# Altium schematic sheet AND_OR_XOR_NOT.SchDoc
size A
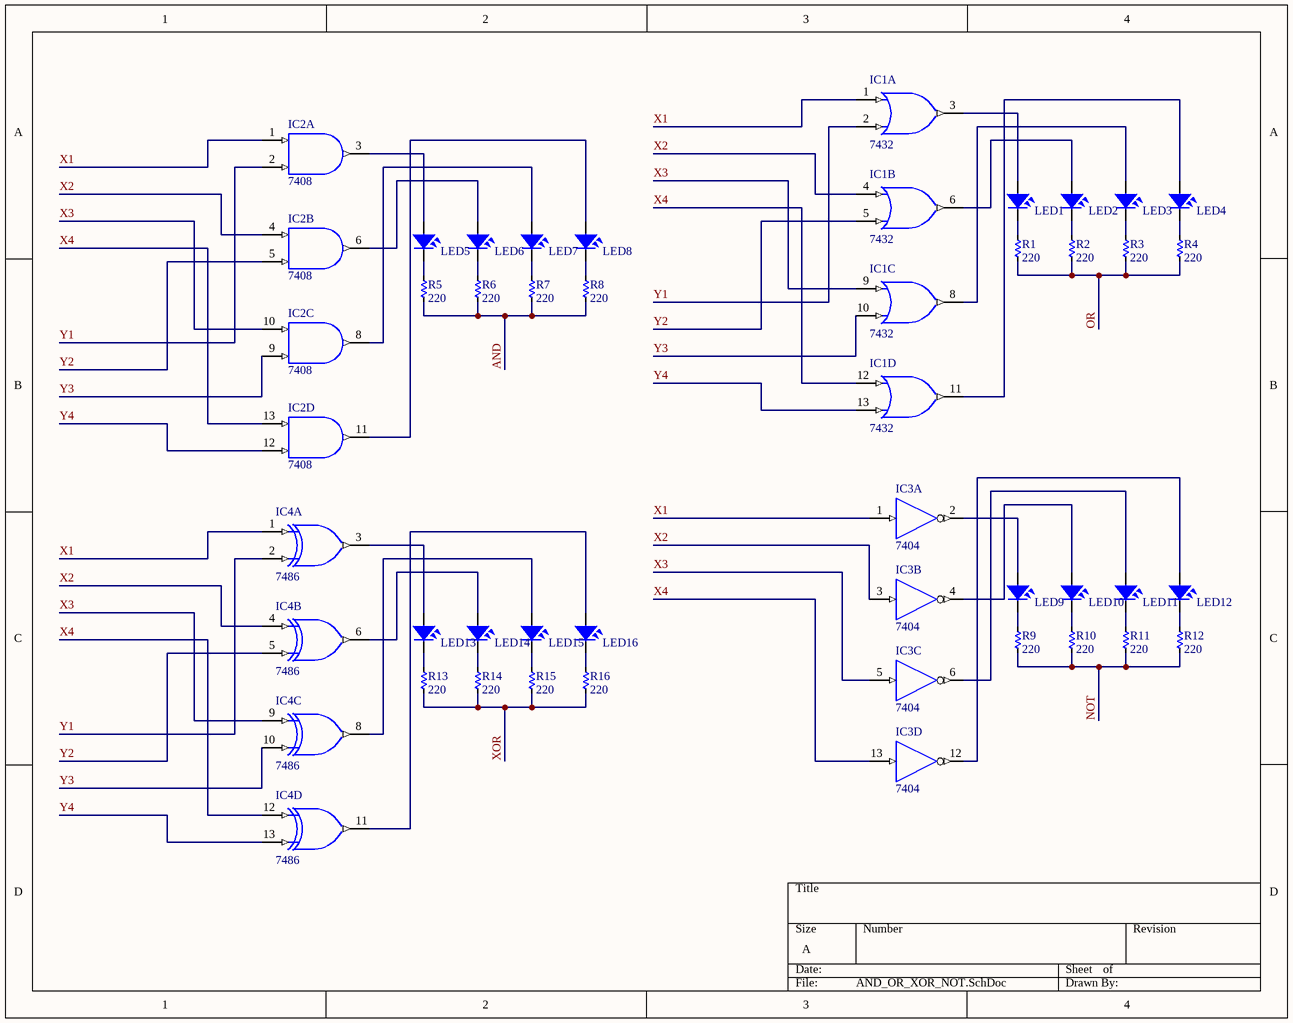
[diagram p0: AND_OR_XOR_NOT.SchDoc]

## Parts
IC1  7432  [DIP14]  (parts A,B,C,D of 4)
IC2  7408  [DIP14]  (parts A,B,C,D of 4)
IC3  7404  [DIP14]  (parts A,B,C,D of 6)
IC4  7486  [DIP14]  (parts A,B,C,D of 4)
LED1  LED  [LED-3MM-YELLOW]  (value not drawn)
LED2  LED  [LED-3MM-YELLOW]  (value not drawn)
LED3  LED  [LED-3MM-YELLOW]  (value not drawn)
LED4  LED  [LED-3MM-YELLOW]  (value not drawn)
LED5  LED  [LED-3MM-YELLOW]  (value not drawn)
LED6  LED  [LED-3MM-YELLOW]  (value not drawn)
LED7  LED  [LED-3MM-YELLOW]  (value not drawn)
LED8  LED  [LED-3MM-YELLOW]  (value not drawn)
LED9  LED  [LED-3MM-YELLOW]  (value not drawn)
LED10  LED  [LED-3MM-YELLOW]  (value not drawn)
LED11  LED  [LED-3MM-YELLOW]  (value not drawn)
LED12  LED  [LED-3MM-YELLOW]  (value not drawn)
LED13  LED  [LED-3MM-YELLOW]  (value not drawn)
LED14  LED  [LED-3MM-YELLOW]  (value not drawn)
LED15  LED  [LED-3MM-YELLOW]  (value not drawn)
LED16  LED  [LED-3MM-YELLOW]  (value not drawn)
R1  220  [RES-1/2W]
R2  220  [RES-1/2W]
R3  220  [RES-1/2W]
R4  220  [RES-1/2W]
R5  220  [RES-1/2W]
R6  220  [RES-1/2W]
R7  220  [RES-1/2W]
R8  220  [RES-1/2W]
R9  220  [RES-1/2W]
R10  220  [RES-1/2W]
R11  220  [RES-1/2W]
R12  220  [RES-1/2W]
R13  220  [RES-1/2W]
R14  220  [RES-1/2W]
R15  220  [RES-1/2W]
R16  220  [RES-1/2W]

## Nets
GND: IC1.7(GND) IC2.7(GND) IC3.7(GND) IC4.7(GND)
VCC: IC1.14(VCC) IC2.14(VCC) IC3.14(VCC)
VDD: IC4.14(VDD)
AND: R5.1 R6.1 R7.1 R8.1
NOT: R9.1 R10.1 R11.1 R12.1
OR: R1.1 R2.1 R3.1 R4.1
X1: IC1.1(A) IC2.1(A) IC3.1(A) IC4.1(A)
X2: IC1.4(A) IC2.4(A) IC3.3(A) IC4.4(A)
X3: IC1.9(A) IC2.10(A) IC3.5(A) IC4.9(A)
X4: IC1.12(A) IC2.13(A) IC3.13(A) IC4.12(A)
XOR: R13.1 R14.1 R15.1 R16.1
Y1: IC1.2(B) IC2.2(B) IC4.2(B)
Y2: IC1.5(B) IC2.5(B) IC4.5(B)
Y3: IC1.10(B) IC2.9(B) IC4.10(B)
Y4: IC1.13(B) IC2.12(B) IC4.13(B)
NetIC1_3: IC1.3(Y) LED1.1
NetIC1_6: IC1.6(Y) LED2.1
NetIC1_8: IC1.8(Y) LED3.1
NetIC1_11: IC1.11(Y) LED4.1
NetIC2_3: IC2.3(O) LED5.1
NetIC2_6: IC2.6(O) LED6.1
NetIC2_8: IC2.8(O) LED7.1
NetIC2_11: IC2.11(O) LED8.1
NetIC3_2: IC3.2(~{O}) LED9.1
NetIC3_4: IC3.4(~{O}) LED10.1
NetIC3_6: IC3.6(~{O}) LED11.1
NetIC3_12: IC3.12(~{O}) LED12.1
NetIC4_3: IC4.3(Y) LED13.1
NetIC4_6: IC4.6(Y) LED14.1
NetIC4_8: IC4.8(Y) LED15.1
NetIC4_11: IC4.11(Y) LED16.1
NetLED1_2: LED1.2 R1.2
NetLED2_2: LED2.2 R2.2
NetLED3_2: LED3.2 R3.2
NetLED4_2: LED4.2 R4.2
NetLED5_2: LED5.2 R5.2
NetLED6_2: LED6.2 R6.2
NetLED7_2: LED7.2 R7.2
NetLED8_2: LED8.2 R8.2
NetLED9_2: LED9.2 R9.2
NetLED10_2: LED10.2 R10.2
NetLED11_2: LED11.2 R11.2
NetLED12_2: LED12.2 R12.2
NetLED13_2: LED13.2 R13.2
NetLED14_2: LED14.2 R14.2
NetLED15_2: LED15.2 R15.2
NetLED16_2: LED16.2 R16.2

## Library data of the parts
IC1 = 7432: Quad 2-Input OR Gate
IC2 = 7408: Quad 2-Input AND Gate; Value: 7408
IC3 = 7404: Hex Inverter; Code_IPC: SOIC127P600-14; ComponentLink1Description: Manufacturer Link; ComponentLink1URL: http://www.national.com/; ComponentLink2Description: Datasheet; ComponentLink2URL: http://www.fairchildsemi.com/ds/74/74F04.pdf; Value: 7404
IC4 = 7486: Quad 2-Input XOR Gate; Value: 7486; Copyright by: VanDungEvn@Gmail.com
LED1-LED16 = LED: LED Single colour Green and Red; Value: LED 3 ly Single Colour
R1-R16 = Res: Manufacturer: Generic Components; Class: Passive; SubClass: R; Published: 08/06/2000; Publisher: Altium Hobart Technology Centre